# Altium schematic sheet POWR0009_BCR_Control.SchDoc: BLUEsat BCR
size A3; Description: Sample Title Block; Version: 1.0
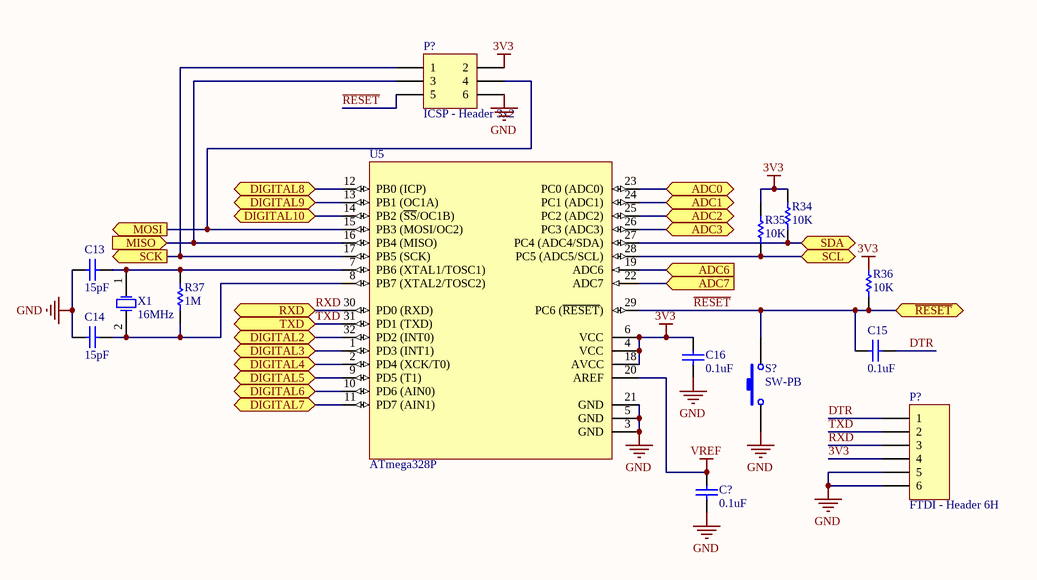
[diagram p0: POWR0009_BCR_Control.SchDoc]

## Parts
(Parts that share a designator on the sheet are numbered #1, #2 ... from top to bottom, then left to right.)
C13  value 15pF  [CAPC1608M]  (hidden comment: Cap)
C14  value 15pF  [CAPC1608M]  (hidden comment: Cap)
C15  value 0.1uF  [CAPC2012M]  (hidden comment: Cap)
C16  value 0.1uF  [CAPC2012M]  (hidden comment: Cap)
C?  value 0.1uF  [CAPC2012M]  (hidden comment: Cap)
P?#1  ICSP - Header 3x2  [HDR2X3]
P?#2  FTDI - Header 6H  [HDR1X6H]
R34  value 10K  [RESC2012M]  (hidden comment: Res1)
R35  value 10K  [RESC2012M]  (hidden comment: Res1)
R36  value 10K  [RESC2012M]  (hidden comment: Res1)
R37  value 1M  [RESC2012M]  (hidden comment: Res1)
S?  SW-PB  [RESET SWITCH]
U5  ATmega328P  [32A_N]
X1  16MHz  [HC49 - No border]

## Ports
ADC0 (bidir), ADC1 (bidir), ADC2 (bidir), ADC3 (bidir), ADC6 (in), ADC7 (in), DIGITAL2 (bidir), DIGITAL3 (bidir), DIGITAL4 (bidir), DIGITAL5 (bidir), DIGITAL6 (bidir), DIGITAL7 (bidir), DIGITAL8 (bidir), DIGITAL9 (bidir), DIGITAL10 (bidir), MISO (in), MOSI (out), RXD (bidir), SCK (out), SCL (bidir), SDA (bidir), TXD (bidir), ~{RESET} (bidir)

## Nets
3V3: C16.2 P?#1.2 P?#2.4 R34.1 R35.1 U5.4(VCC) U5.6(VCC) U5.18(AVCC)
GND: C13.1 C14.1 C16.1 C?.2 P?#1.6 P?#2.5 P?#2.6 S?.1 U5.3(GND) U5.5(GND) U5.21(GND)
VREF: C?.1 U5.20(AREF)
ADC0: U5.23(PC0_(ADC0)) ; port ADC0
ADC1: U5.24(PC1_(ADC1)) ; port ADC1
ADC2: U5.25(PC2_(ADC2)) ; port ADC2
ADC3: U5.26(PC3_(ADC3)) ; port ADC3
ADC6: U5.19(ADC6) ; port ADC6
ADC7: U5.22(ADC7) ; port ADC7
DIGITAL2: U5.32(PD2_(INT0)) ; port DIGITAL2
DIGITAL3: U5.1(PD3_(INT1)) ; port DIGITAL3
DIGITAL4: U5.2(PD4_(XCK/T0)) ; port DIGITAL4
DIGITAL5: U5.9(PD5_(T1)) ; port DIGITAL5
DIGITAL6: U5.10(PD6_(AIN0)) ; port DIGITAL6
DIGITAL7: U5.11(PD7_(AIN1)) ; port DIGITAL7
DIGITAL8: U5.12(PB0_(ICP)) ; port DIGITAL8
DIGITAL9: U5.13(PB1_(OC1A)) ; port DIGITAL9
DIGITAL10: U5.14(PB2_(~{SS}/OC1B)) ; port DIGITAL10
DTR: C15.1 P?#2.1
MISO: P?#1.3 U5.16(PB4_(MISO)) ; port MISO
MOSI: P?#1.4 U5.15(PB3_(MOSI/OC2)) ; port MOSI
~{RESET}: C15.2 P?#1.5 R36.2 S?.2 U5.29(PC6_(~{RESET})) ; port ~{RESET}
RXD: P?#2.3 U5.30(PD0_(RXD)) ; port RXD
SCK: P?#1.1 U5.17(PB5_(SCK)) ; port SCK
SCL: R35.2 U5.28(PC5_(ADC5/SCL)) ; port SCL
SDA: R34.2 U5.27(PC4_(ADC4/SDA)) ; port SDA
TXD: P?#2.2 U5.31(PD1_(TXD)) ; port TXD
NetC13_2: C13.2 R37.1 U5.7(PB6_(XTAL1/TOSC1)) X1.1(OSC1)
NetC14_2: C14.2 R37.2 U5.8(PB7_(XTAL2/TOSC2)) X1.2(OSC2)

Not connected (* = marked no-connect by the designer): R36 1

## Notes on the sheet
- Labels drawn without touching a wire or pin: 3V3
- Title
- Description:
- Size:
- Author:
- Date:
- A3
- Time:
- Version
- Sheet:
- Drawing No.:
- of
- File:

## Library data of the parts
C13-C16 C? = Cap: Capacitor; Published: 8-Jun-2000; LatestRevisionDate: 17-Jul-2002; LatestRevisionNote: Re-released for DXP Platform.; PackageReference: RAD-0.3; Publisher: Altium Limited; PackageDescription: Radial Cap, Thru-Hole; 2 Leads; 0.3 in Pin Spacing; Supplier 1: Farnell; Supplier 2: Farnell; Supplier Part Number 2: 1759265
P?#1 = Header 3X2: Header, 3-Pin, Dual row; LatestRevisionDate: 17-Jul-2002; LatestRevisionNote: Re-released for DXP Platform.; Publisher: Altium Limited
P?#2 = Header 6H: Header, 6-Pin, Right Angle; LatestRevisionDate: 17-Jul-2002; LatestRevisionNote: Re-released for DXP Platform.; Publisher: Altium Limited
R34-R37 = Res1: Resistor; Published: 8-Jun-2000; LatestRevisionDate: 17-Jul-2002; LatestRevisionNote: Re-released for DXP Platform.; PackageReference: AXIAL-0.3; Publisher: Altium Limited; PackageDescription: Axial Device, Thru-Hole; 2 Leads; 0.3 in Pin Spacing; Supplier 1: Farnell
S? = SW-PB: Switch; Published: 24-Mar-1999; LatestRevisionDate: 17-Jul-2002; LatestRevisionNote: Re-released for DXP Platform.; PackageReference: SPST-2; Publisher: Altium Limited; PackageDescription: Switch; 2 Leads
U5 = ATmega8-16AC: 8-Bit AVR Microcontroller with 8K Bytes of In-System Programmable Flash Memory; Published: 17-Sep-2003; LatestRevisionDate: 13-Apr-2006; LatestRevisionNote: IPC-7351 Footprint Added.; DatasheetVersion: 2486H-AVR-09/02; PackageVersion: revB, Oct-2001; PackageReference: 32A; Publisher: Altium Limited; PackageDescription: 32-Pin Thin Quad Flat Pack 0.8 mm Pitch; Code_JEDEC: MS-026-ABA; ComponentLink1Description: Manufacturer Link; ComponentLink1URL: http://www.atmel.com; ComponentLink2Description: Datasheet; ComponentLink2URL: http://www.atmel.com/dyn/resources/prod_documents/doc2486.pdf
X1 = ECS-110-S-5P: Crystal Oscillator; Published: 17-Jul-2002; DatasheetDocument: 18-Apr-2000; PackageReference: CSM-7; Publisher: Altium Limited; ComponentLink1Description: Manufacturer Link; ComponentLink1URL: http://www.ecsxtal.com/; ComponentLink2Description: Datasheet; ComponentLink2URL: http://www.ecsxtal.com/pdf3/CSM_7.pdf